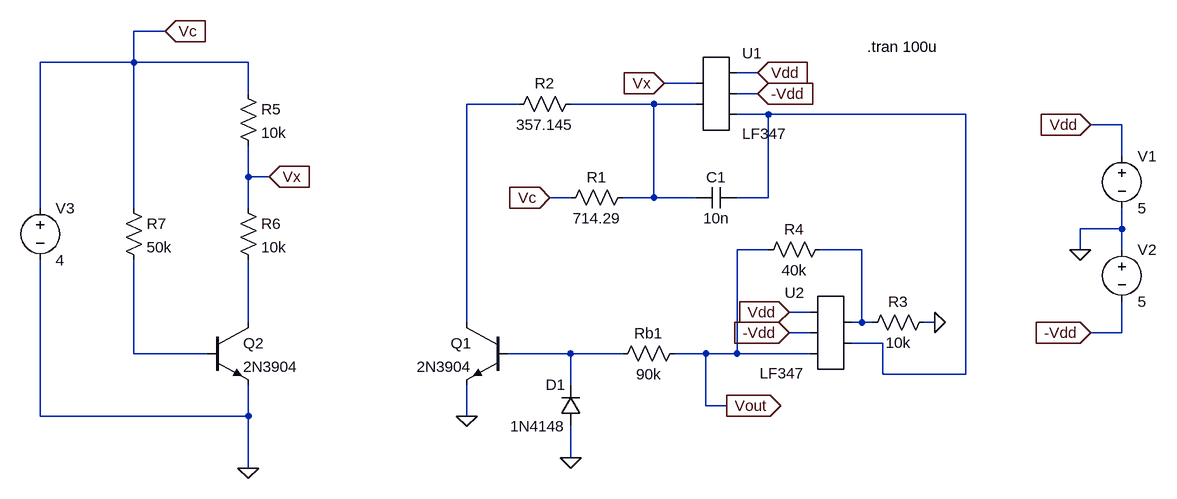
[diagram p0: schematic Q3.2.asc]
Q3.2.asc, the LTspice schematic file:
Version 4
SHEET 1 1132 784
WIRE -400 96 -448 96
WIRE -448 144 -448 96
WIRE -448 144 -592 144
WIRE -272 144 -448 144
WIRE 512 160 480 160
WIRE 416 176 368 176
WIRE -272 192 -272 144
WIRE 512 192 480 192
WIRE 144 208 64 208
WIRE 352 208 224 208
WIRE 416 208 352 208
WIRE 528 224 480 224
WIRE 832 224 528 224
WIRE 1072 240 1024 240
WIRE 1072 288 1072 240
WIRE -272 320 -272 272
WIRE -240 320 -272 320
WIRE 224 352 192 352
WIRE 352 352 352 208
WIRE 352 352 304 352
WIRE 416 352 352 352
WIRE 528 352 528 224
WIRE 528 352 480 352
WIRE -592 368 -592 144
WIRE -448 368 -448 144
WIRE -272 368 -272 320
WIRE 1072 400 1072 368
WIRE 1072 400 1008 400
WIRE 528 432 480 432
WIRE 672 432 608 432
WIRE 1008 432 1008 400
WIRE 1072 432 1072 400
WIRE 592 528 560 528
WIRE -272 544 -272 448
WIRE 64 544 64 208
WIRE 672 544 672 432
WIRE 672 544 656 544
WIRE 688 544 672 544
WIRE 784 544 768 544
WIRE 592 560 560 560
WIRE 1072 560 1072 512
WIRE 1072 560 1024 560
WIRE 704 576 656 576
WIRE -448 592 -448 448
WIRE -336 592 -448 592
WIRE 224 592 128 592
WIRE 304 592 224 592
WIRE 432 592 384 592
WIRE 480 592 480 432
WIRE 480 592 432 592
WIRE 592 592 480 592
WIRE 704 624 704 576
WIRE 832 624 832 224
WIRE 832 624 704 624
WIRE 224 640 224 592
WIRE 432 672 432 592
WIRE 464 672 432 672
WIRE -592 688 -592 448
WIRE -272 688 -272 640
WIRE -272 688 -592 688
WIRE 64 688 64 640
WIRE 224 752 224 704
WIRE -272 768 -272 688
FLAG 1008 432 0
FLAG 1024 240 Vdd
IOPIN 1024 240 In
FLAG 1024 560 -Vdd
IOPIN 1024 560 In
FLAG 512 160 Vdd
IOPIN 512 160 In
FLAG 512 192 -Vdd
IOPIN 512 192 In
FLAG 784 544 0
FLAG 560 528 Vdd
IOPIN 560 528 In
FLAG 560 560 -Vdd
IOPIN 560 560 In
FLAG 64 688 0
FLAG 368 176 Vx
IOPIN 368 176 In
FLAG 192 352 Vc
IOPIN 192 352 In
FLAG 224 752 0
FLAG 464 672 Vout
IOPIN 464 672 Out
FLAG -272 768 0
FLAG -400 96 Vc
IOPIN -400 96 In
FLAG -240 320 Vx
IOPIN -240 320 In
SYMBOL AutoGenerated/LF347 448 192 R0
SYMATTR InstName U1
SYMBOL res 320 336 R90
WINDOW 0 0 56 VBottom 2
WINDOW 3 32 56 VTop 2
SYMATTR InstName R1
SYMATTR Value 714.29
SYMBOL cap 480 336 R90
WINDOW 0 0 32 VBottom 2
WINDOW 3 32 32 VTop 2
SYMATTR InstName C1
SYMATTR Value 10n
SYMBOL voltage 1072 272 R0
SYMATTR InstName V1
SYMATTR Value 5
SYMBOL voltage 1072 416 R0
SYMATTR InstName V2
SYMATTR Value 5
SYMBOL res 240 192 R90
WINDOW 0 0 56 VBottom 2
WINDOW 3 32 56 VTop 2
SYMATTR InstName R2
SYMATTR Value 357.145
SYMBOL npn 128 544 M0
SYMATTR InstName Q1
SYMATTR Value 2N3904
SYMBOL AutoGenerated/LF347 624 560 M0
SYMATTR InstName U2
SYMBOL res 784 528 R90
WINDOW 0 0 56 VBottom 2
WINDOW 3 32 56 VTop 2
SYMATTR InstName R3
SYMATTR Value 10k
SYMBOL res 624 416 R90
WINDOW 0 0 56 VBottom 2
WINDOW 3 32 56 VTop 2
SYMATTR InstName R4
SYMATTR Value 40k
SYMBOL res 400 576 R90
WINDOW 0 0 56 VBottom 2
WINDOW 3 32 56 VTop 2
SYMATTR InstName Rb1
SYMATTR Value 90k
SYMBOL diode 240 704 R180
WINDOW 0 24 64 Left 2
WINDOW 3 24 0 Left 2
SYMATTR InstName D1
SYMATTR Value 1N4148
SYMBOL voltage -592 352 R0
SYMATTR InstName V3
SYMATTR Value 4
SYMBOL res -288 176 R0
SYMATTR InstName R5
SYMATTR Value 10k
SYMBOL res -288 352 R0
SYMATTR InstName R6
SYMATTR Value 10k
SYMBOL res -464 352 R0
SYMATTR InstName R7
SYMATTR Value 50k
SYMBOL npn -336 544 R0
SYMATTR InstName Q2
SYMATTR Value 2N3904
TEXT 680 120 Left 2 !.tran 100u

The netlist it stands for:
* Q3.2.asc
* U1: LF347 (symbol AutoGenerated/LF347 not available, pins judged from their places): pin1=Vx pin2=N002 pin3=Vdd pin4=-Vdd pin5=N003
R1 N002 Vc 714.29
C1 N003 N002 10n
V1 Vdd 0 5
V2 0 -Vdd 5
R2 N002 N001 357.145
Q1 N001 N007 0 0 2N3904
* U2: LF347 (symbol AutoGenerated/LF347 not available, pins judged from their places): pin1=N004 pin2=N003 pin3=Vdd pin4=-Vdd pin5=Vout
R3 0 N004 10k
R4 N004 Vout 40k
Rb1 Vout N007 90k
D1 0 N007 1N4148
V3 Vc 0 4
R5 Vc Vx 10k
R6 Vx N005 10k
R7 Vc N006 50k
Q2 N005 N006 0 0 2N3904
.model D D
.lib standard.dio
.model NPN NPN
.model PNP PNP
.lib standard.bjt
.tran 100u
.backanno
.end